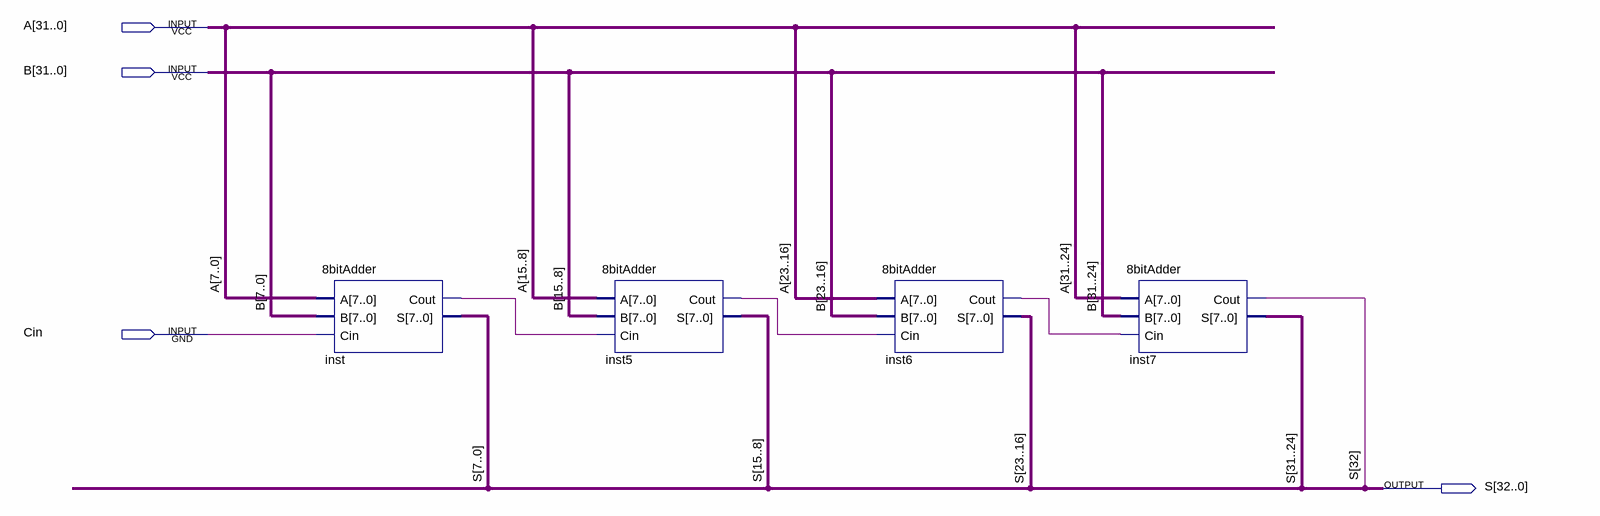
[diagram p0: schematic sheet]
// Quartus schematic 32bitAdder.bdf as structural Verilog: 4 symbols, 4 pins
module \32bitAdder  (
  input  [31:0] A,
  input  [31:0] B,
  input  Cin,
  output [32:0] S
);

  wire inst5_cout, inst6_cout, inst_cout;

  \8bitAdder  inst (.A(A[7:0]), .B(B[7:0]), .Cin(Cin), .Cout(inst_cout), .S(S[7:0]));
  \8bitAdder  inst5 (.A(A[15:8]), .B(B[15:8]), .Cin(inst_cout), .Cout(inst5_cout), .S(S[15:8]));
  \8bitAdder  inst6 (.A(A[23:16]), .B(B[23:16]), .Cin(inst5_cout), .Cout(inst6_cout), .S(S[23:16]));
  \8bitAdder  inst7 (.A(A[31:24]), .B(B[31:24]), .Cin(inst6_cout), .Cout(S[32]), .S(S[31:24]));
endmodule
